# Altium project PRJ_cmv4000.PrjPcb
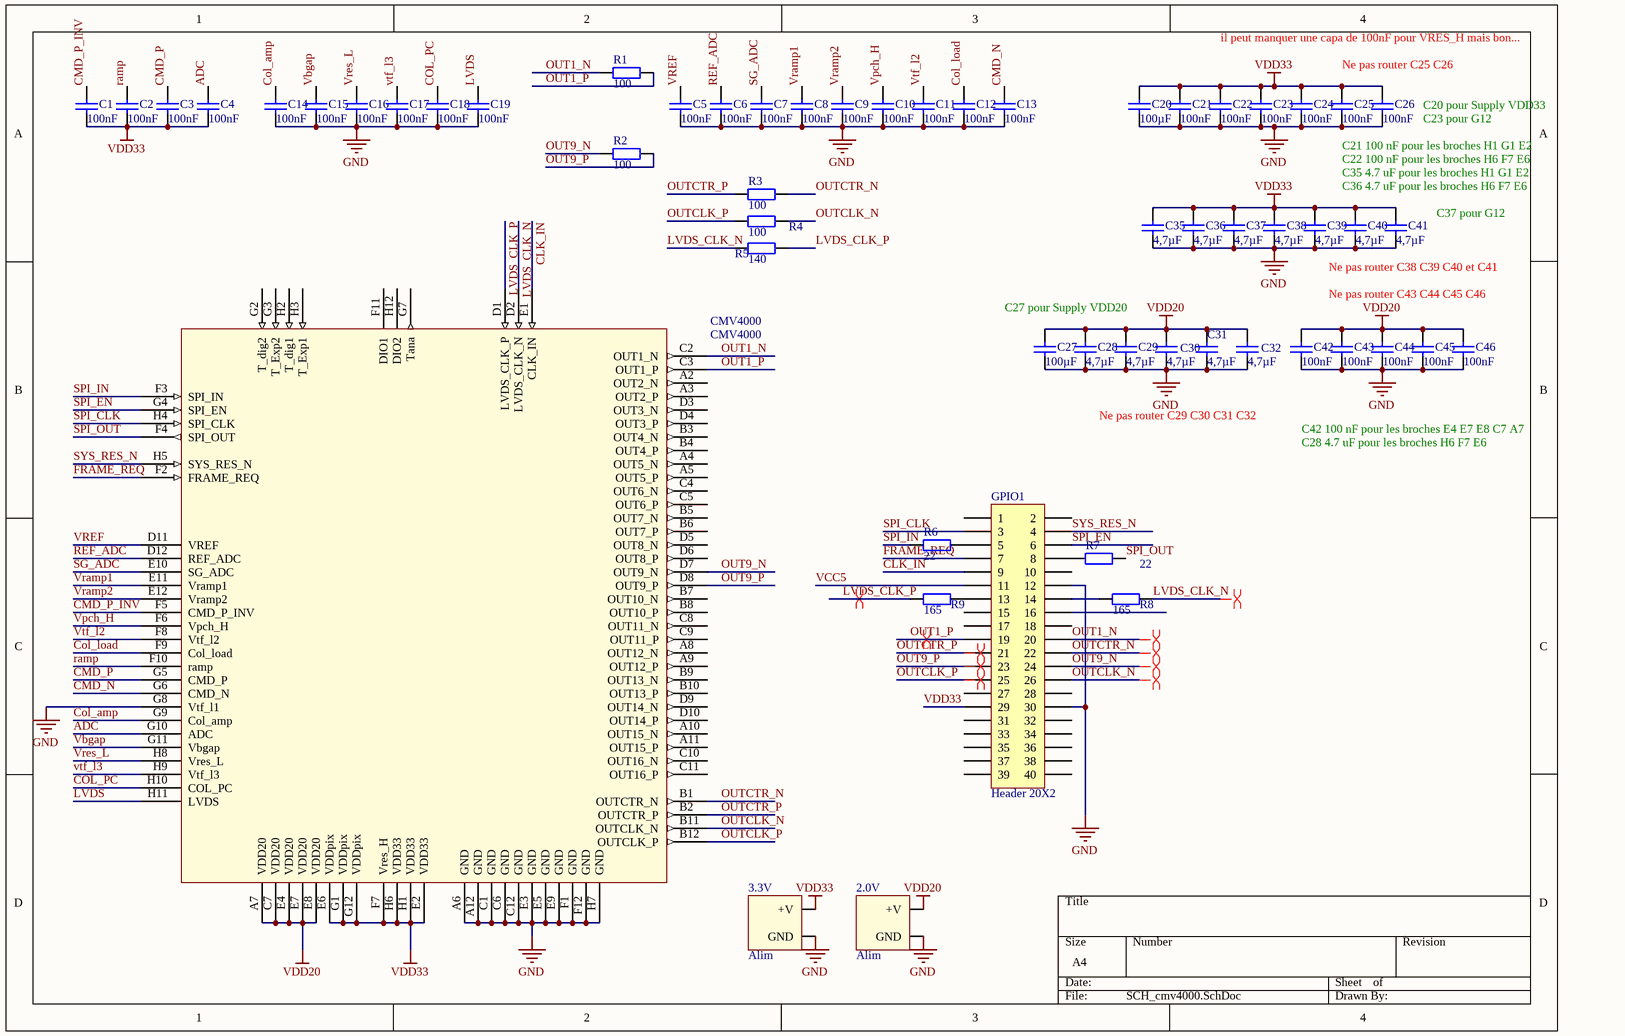
[diagram p0: SCH_cmv4000.SchDoc]
1 sheet, 57 parts. Net scope: global (net labels, ports and power ports of the same name join across sheets).
Board file: PCB_cmv4000.PcbDoc

## Sheet SCH_cmv4000.SchDoc
size A4

### Parts
2.0V  Alim  [HDR1X2]
3.3V  Alim  [HDR1X2]
C1  value 100nF  [C1206]  (hidden comment: Cap Semi)
C2  value 100nF  [C1206]  (hidden comment: Cap Semi)
C3  value 100nF  [C1206]  (hidden comment: Cap Semi)
C4  value 100nF  [C1206]  (hidden comment: Cap Semi)
C5  value 100nF  [C1206]  (hidden comment: Cap Semi)
C6  value 100nF  [C1206]  (hidden comment: Cap Semi)
C7  value 100nF  [C1206]  (hidden comment: Cap Semi)
C8  value 100nF  [C1206]  (hidden comment: Cap Semi)
C9  value 100nF  [C1206]  (hidden comment: Cap Semi)
C10  value 100nF  [C1206]  (hidden comment: Cap Semi)
C11  value 100nF  [C1206]  (hidden comment: Cap Semi)
C12  value 100nF  [C1206]  (hidden comment: Cap Semi)
C13  value 100nF  [C1206]  (hidden comment: Cap Semi)
C14  value 100nF  [C1206]  (hidden comment: Cap Semi)
C15  value 100nF  [C1206]  (hidden comment: Cap Semi)
C16  value 100nF  [C1206]  (hidden comment: Cap Semi)
C17  value 100nF  [C1206]  (hidden comment: Cap Semi)
C18  value 100nF  [C1206]  (hidden comment: Cap Semi)
C19  value 100nF  [C1206]  (hidden comment: Cap Semi)
C20  value 100µF  [C1206]  (hidden comment: Cap Semi)
C21  value 100nF  [C1206]  (hidden comment: Cap Semi)
C22  value 100nF  [C1206]  (hidden comment: Cap Semi)
C23  value 100nF  [C1206]  (hidden comment: Cap Semi)
C24  value 100nF  [C1206]  (hidden comment: Cap Semi)
C25  value 100nF  [C1206]  (hidden comment: Cap Semi)
C26  value 100nF  [C1206]  (hidden comment: Cap Semi)
C27  value 100µF  [C1206]  (hidden comment: Cap Semi)
C28  value 4,7µF  [C1206]  (hidden comment: Cap Semi)
C29  value 4,7µF  [C1206]  (hidden comment: Cap Semi)
C30  value 4,7µF  [C1206]  (hidden comment: Cap Semi)
C31  value 4,7µF  [C1206]  (hidden comment: Cap Semi)
C32  value 4,7µF  [C1206]  (hidden comment: Cap Semi)
C35  value 4,7µF  [C1206]  (hidden comment: Cap Semi)
C36  value 4,7µF  [C1206]  (hidden comment: Cap Semi)
C37  value 4,7µF  [C1206]  (hidden comment: Cap Semi)
C38  value 4,7µF  [C1206]  (hidden comment: Cap Semi)
C39  value 4,7µF  [C1206]  (hidden comment: Cap Semi)
C40  value 4,7µF  [C1206]  (hidden comment: Cap Semi)
C41  value 4,7µF  [C1206]  (hidden comment: Cap Semi)
C42  value 100nF  [C1206]  (hidden comment: Cap Semi)
C43  value 100nF  [C1206]  (hidden comment: Cap Semi)
C44  value 100nF  [C1206]  (hidden comment: Cap Semi)
C45  value 100nF  [C1206]  (hidden comment: Cap Semi)
C46  value 100nF  [C1206]  (hidden comment: Cap Semi)
CMV4000  CMV4000  [PGA940]
GPIO1  Header 20X2  [HDR2X20]
R1  100  [1206-R]
R2  100  [1206-R]
R3  100  [1206-R]
R4  100  [1206-R]
R5  140  [1206-R]
R6  22  [1206-R]
R7  22  [1206-R]
R8  165  [1206-R]
R9  165  [1206-R]

### Nets
GND: 2.0V.1(GND) 3.3V.1(GND) C5.1 C6.1 C7.1 C8.1 C9.1 C10.1 C11.1 C12.1 C13.1 C14.1 C15.1 C16.1 C17.1 C18.1 C19.1 C20.1 C21.1 C22.1 C23.1 C24.1 C25.1 C26.1 C27.1 C28.1 C29.1 C30.1 C31.1 C32.1 C35.1 C36.1 C37.1 C38.1 C39.1 C40.1 C41.1 C42.1 C43.1 C44.1 C45.1 C46.1 CMV4000.A6(GND) CMV4000.A12(GND) CMV4000.C1(GND) CMV4000.C6(GND) CMV4000.C12(GND) CMV4000.E3(GND) CMV4000.E5(GND) CMV4000.E9(GND) CMV4000.F1(GND) CMV4000.F12(GND) CMV4000.G8(Vtf_l1) CMV4000.H7(GND) GPIO1.12 GPIO1.30
VDD20: 2.0V.2(+V) C27.2 C28.2 C29.2 C30.2 C31.2 C32.2 C42.2 C43.2 C44.2 C45.2 C46.2 CMV4000.A7(VDD20) CMV4000.C7(VDD20) CMV4000.E4(VDD20) CMV4000.E7(VDD20) CMV4000.E8(VDD20)
VDD33: 3.3V.2(+V) C1.1 C2.1 C3.1 C4.1 C20.2 C21.2 C22.2 C23.2 C24.2 C25.2 C26.2 C35.2 C36.2 C37.2 C38.2 C39.2 C40.2 C41.2 CMV4000.E2(VDD33) CMV4000.E6(VDDpix) CMV4000.F7(Vres_H) CMV4000.G1(VDDpix) CMV4000.G12(VDDpix) CMV4000.H1(VDD33) CMV4000.H6(VDD33) GPIO1.29
ADC: C4.2 CMV4000.G10(ADC)
CLK_IN: CMV4000.E1(CLK_IN) GPIO1.9
CMD_N: C13.2 CMV4000.G6(CMD_N)
CMD_P: C3.2 CMV4000.G5(CMD_P)
CMD_P_INV: C1.2 CMV4000.F5(CMD_P_INV)
Col_amp: C14.2 CMV4000.G9(Col_amp)
Col_load: C12.2 CMV4000.F9(Col_load)
COL_PC: C18.2 CMV4000.H10(COL_PC)
FRAME_REQ: CMV4000.F2(FRAME_REQ) GPIO1.7
LVDS: C19.2 CMV4000.H11(LVDS)
LVDS_CLK_N: CMV4000.D2(LVDS_CLK_N) R5.1 R8.2
LVDS_CLK_P: CMV4000.D1(LVDS_CLK_P) R5.2 R9.1
OUT1_N: CMV4000.C2(OUT1_N) GPIO1.20 R1.1
OUT1_P: CMV4000.C3(OUT1_P) GPIO1.19 R1.2
OUT9_N: CMV4000.D7(OUT9_N) GPIO1.24 R2.1
OUT9_P: CMV4000.D8(OUT9_P) GPIO1.23 R2.2
OUTCLK_N: CMV4000.B11(OUTCLK_N) GPIO1.26 R4.2
OUTCLK_P: CMV4000.B12(OUTCLK_P) GPIO1.25 R4.1
OUTCTR_N: CMV4000.B1(OUTCTR_N) GPIO1.22 R3.2
OUTCTR_P: CMV4000.B2(OUTCTR_P) GPIO1.21 R3.1
ramp: C2.2 CMV4000.F10(ramp)
REF_ADC: C6.2 CMV4000.D12(REF_ADC)
SG_ADC: C7.2 CMV4000.E10(SG_ADC)
SPI_CLK: CMV4000.H4(SPI_CLK) GPIO1.3
SPI_EN: CMV4000.G4(SPI_EN) GPIO1.6
SPI_IN: CMV4000.F3(SPI_IN) R6.1
SPI_OUT: CMV4000.F4(SPI_OUT) R7.2
SYS_RES_N: CMV4000.H5(SYS_RES_N) GPIO1.4
Vbgap: C15.2 CMV4000.G11(Vbgap)
VCC5: GPIO1.11
Vpch_H: C10.2 CMV4000.F6(Vpch_H)
Vramp1: C8.2 CMV4000.E11(Vramp1)
Vramp2: C9.2 CMV4000.E12(Vramp2)
VREF: C5.2 CMV4000.D11(VREF)
Vres_L: C16.2 CMV4000.H8(Vres_L)
Vtf_l2: C11.2 CMV4000.F8(Vtf_l2)
vtf_l3: C17.2 CMV4000.H9(Vtf_l3)
NetGPIO1_5: GPIO1.5 R6.2
NetGPIO1_8: GPIO1.8 R7.1
NetGPIO1_13: GPIO1.13 R9.2
NetGPIO1_14: GPIO1.14 R8.1

Not connected (* = marked no-connect by the designer): CMV4000 A2(OUT2_N) A3(OUT2_P) A4(OUT5_N) A5(OUT5_P) A8(OUT12_N) A9(OUT12_P) A10(OUT15_N) A11(OUT15_P) B3(OUT4_N) B4(OUT4_P) B5(OUT7_N) B6(OUT7_P) B7(OUT10_N) B8(OUT10_P) B9(OUT13_N) B10(OUT13_P) C4(OUT6_N) C5(OUT6_P) C8(OUT11_N) C9(OUT11_P) C10(OUT16_N) C11(OUT16_P) D3(OUT3_N) D4(OUT3_P) D5(OUT8_N) D6(OUT8_P) D9(OUT14_N) D10(OUT14_P) F11(DIO1) G2(T_dig2) G3(T_Exp2) G7(Tana) H2(T_dig1) H3(T_Exp1) H12(DIO2); GPIO1 1 2 10 15 16 17 18 27 28 31 32 33 34 35 36 37 38 39 40

### Layout directives
differential pair: LVDS_CLK_N, LVDS_CLK_P, OUT1_N, OUT1_P, OUT9_N, OUT9_P, OUTCLK_N, OUTCLK_P, OUTCTR_N, OUTCTR_P

### Notes on the sheet
- il peut manquer une capa de 100nF pour VRES_H mais bon...
- Ne pas router C25 C26
- (near C26) C20 pour Supply VDD33
- C21 100 nF pour les broches H1 G1 E2
- C35 4.7 uF pour les broches H1 G1 E2
- C22 100 nF pour les broches H6 F7 E6
- (near C26) C23 pour G12
- C36 4.7 uF pour les broches H6 F7 E6
- (near C41) C37 pour G12
- C27 pour Supply VDD20
- Ne pas router C38 C39 C40 et C41
- Ne pas router C43 C44 C45 C46
- Ne pas router C29 C30 C31 C32
- C28 4.7 uF pour les broches H6 F7 E6
- C42 100 nF pour les broches E4 E7 E8 C7 A7

### Library data of the parts
2.0V 3.3V = Connecteur Alimentation: Connecteur d'alimentation; Manufacturer: IMO PRECISION CONTROLS; Manufacturer Part Number: 21.95MH/2; Supplier 1: Farnell; Supplier Part Number 1: 9633197; RoHS: YES; Stock 1: 1666; Pricing 1: 1=0,36, 25=0,35, 100=0,31, 250=0,29, 500=0,27 (EUR); ComponentLink1URL: http://www.farnell.com/cad/80517.pdf; ComponentLink1Description: http://www.farnell.com/cad/80517.pdf
C1-C32 C35-C46 = Cap Semi: Capacitor (Semiconductor SIM Model); Published: 8-Jun-2000; LatestRevisionDate: 29-May-2009; LatestRevisionNote: IPC-7351 Footprint Added.; PackageReference: C1206; Publisher: Altium Limited; PackageDescription: Chip Capacitor
GPIO1 = Header 20X2: Header, 20-Pin, Dual row; LatestRevisionDate: 17-Jul-2002; LatestRevisionNote: Re-released for DXP Platform.; Publisher: Altium Limited
R1-R9 = Res: Resistance; Published: 8-Jun-2000; Revision: July-2002: Re-released for DXP Platform.; Publisher: Altium Limited; Supplier 2: Farnell; Supplier Part Number 2: 2057836
  R1-R4: Value: 100
  R5: Value: 140
  R6 R7: Value: 22
  R8 R9: Value: 165